# EAGLE design oresat-backplane-for-0.3 (EAGLE 7.3.0)

## Sheet 1 of 3
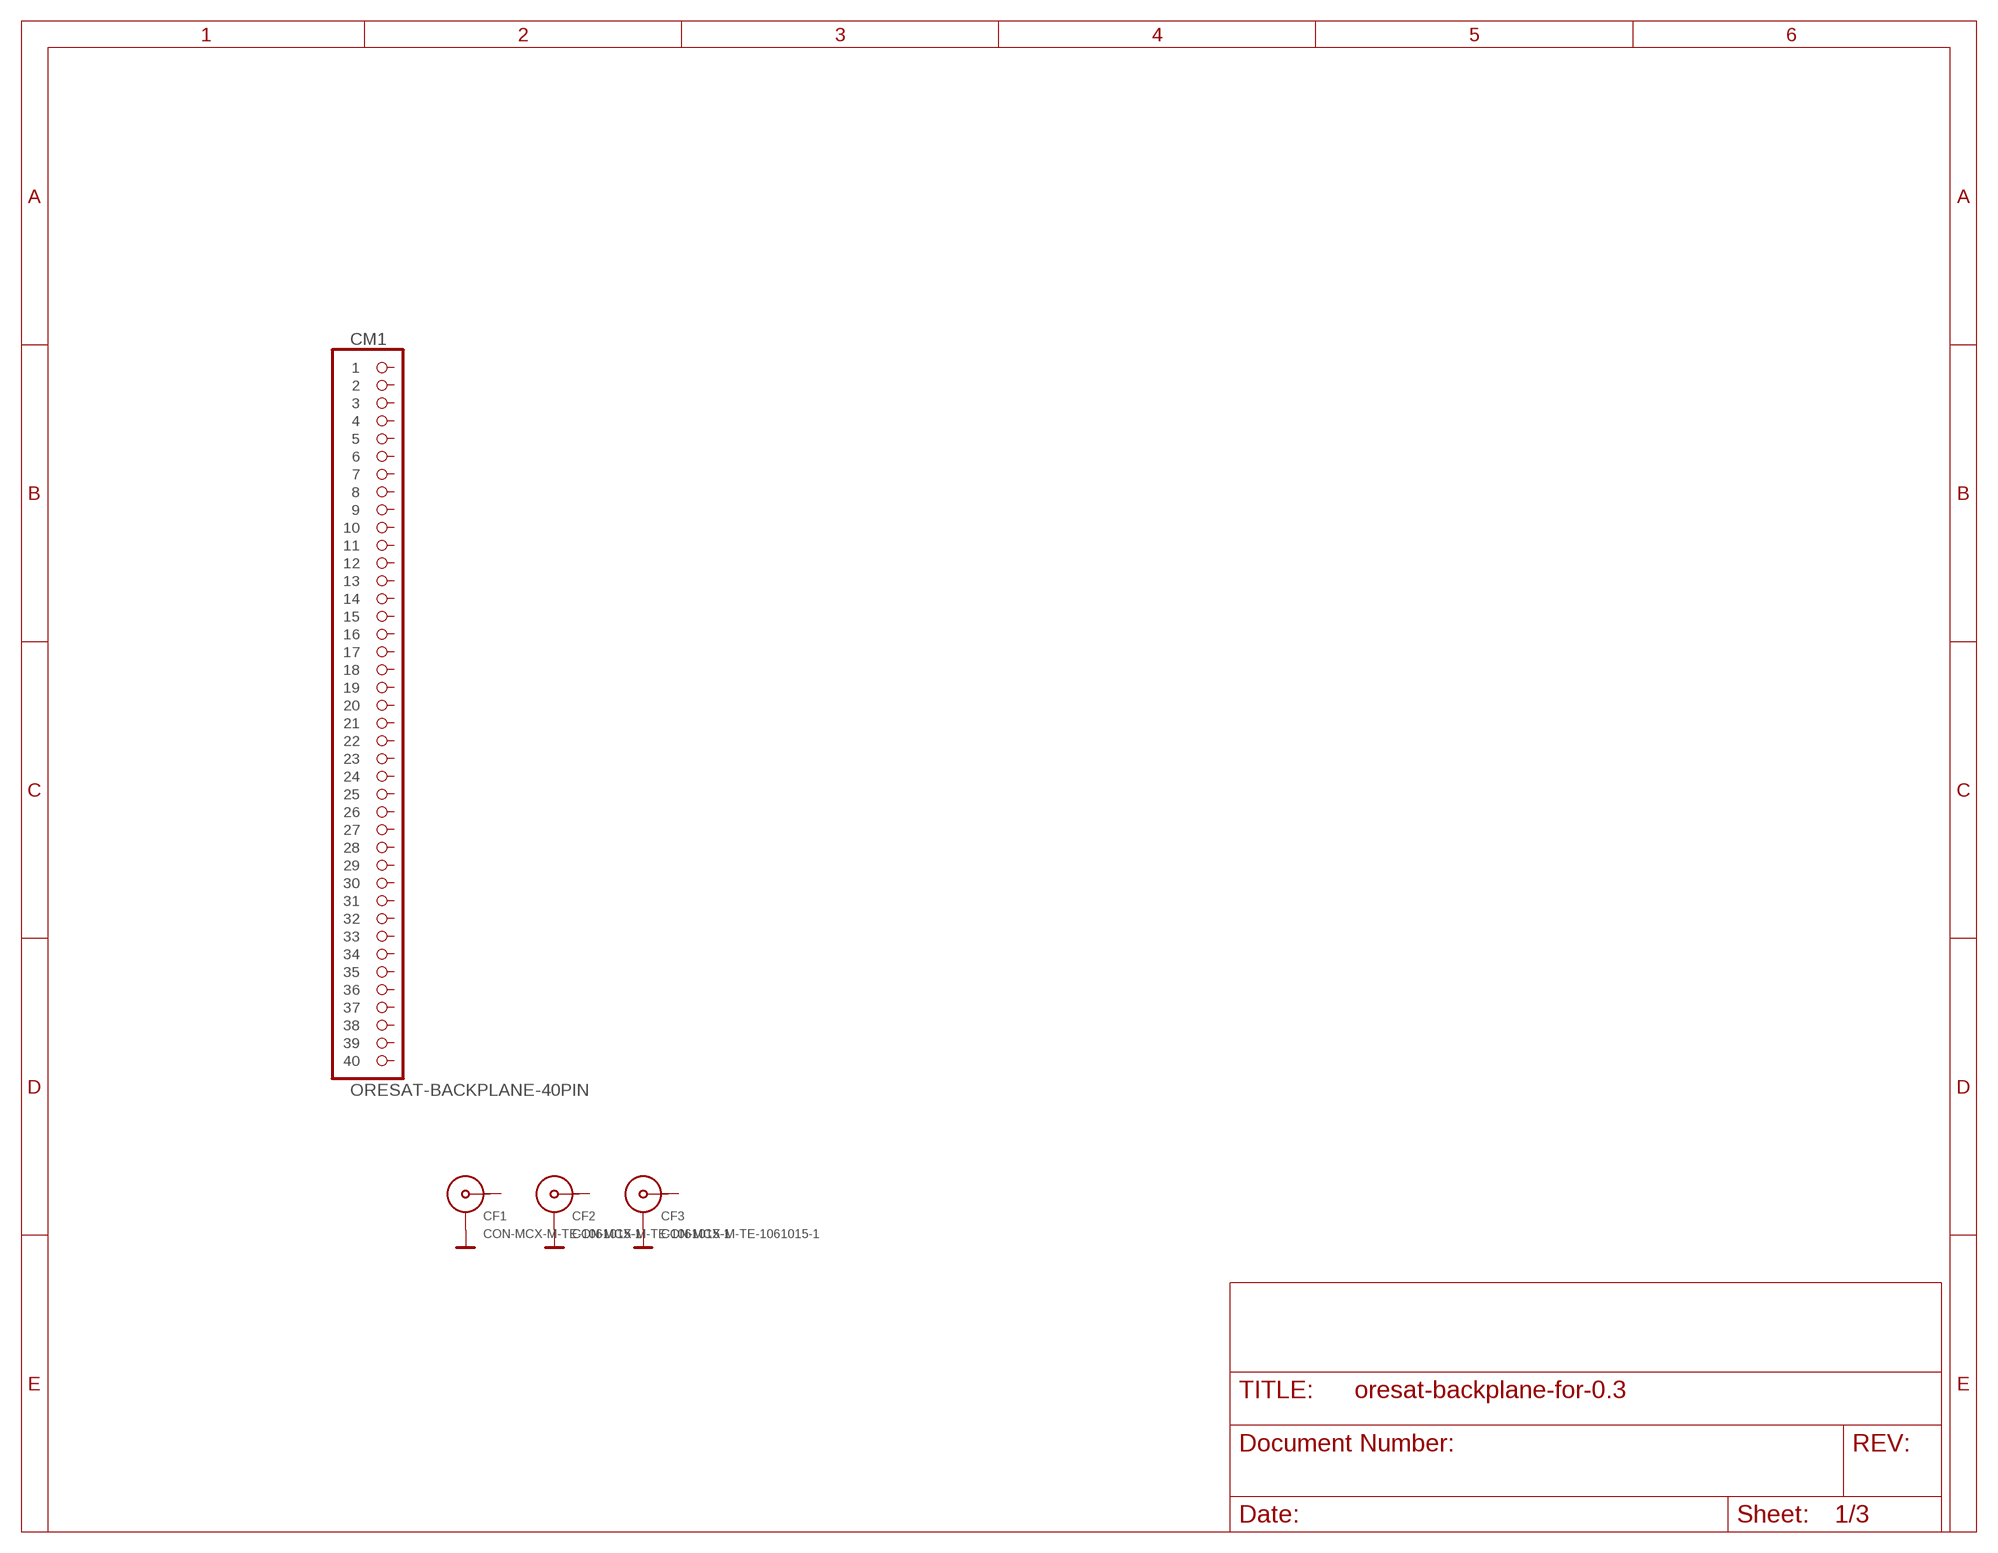
[diagram p0: schematic, sheet 1]

### Parts
CF1  CON-MCX-M-TE-1061015-1  [CONN_1061015-1_TYCO]
CF2  CON-MCX-M-TE-1061015-1  [CONN_1061015-1_TYCO]
CF3  CON-MCX-M-TE-1061015-1  [CONN_1061015-1_TYCO]
CM1  ORESAT-BACKPLANE-40PIN  [HARWIN-ARCHER-M50-3502042]

### Nets
GND: CF1.SHIELD1(SHIELD) CF1.SHIELD2(SHIELD) CF1.SHIELD3(SHIELD) CF1.SHIELD4(SHIELD) CF2.SHIELD1(SHIELD) CF2.SHIELD2(SHIELD) CF2.SHIELD3(SHIELD) CF2.SHIELD4(SHIELD) CF3.SHIELD1(SHIELD) CF3.SHIELD2(SHIELD) CF3.SHIELD3(SHIELD) CF3.SHIELD4(SHIELD) ; also sheet 2,3
Unconnected: CF1.CENTER CF2.CENTER CF3.CENTER CM1.P$1 CM1.P$2 CM1.P$3 CM1.P$4 CM1.P$5 CM1.P$6 CM1.P$7 CM1.P$8 CM1.P$9 CM1.P$10 CM1.P$11 CM1.P$12 CM1.P$13 CM1.P$14 CM1.P$15 CM1.P$16 CM1.P$17 CM1.P$18 CM1.P$19 CM1.P$20 CM1.P$21 CM1.P$22 CM1.P$23 CM1.P$24 CM1.P$25 CM1.P$26 CM1.P$27 CM1.P$28 CM1.P$29 CM1.P$30 CM1.P$31 CM1.P$32 CM1.P$33 CM1.P$34 CM1.P$35 CM1.P$36 CM1.P$37 CM1.P$38 CM1.P$39 CM1.P$40

## Sheet 2 of 3
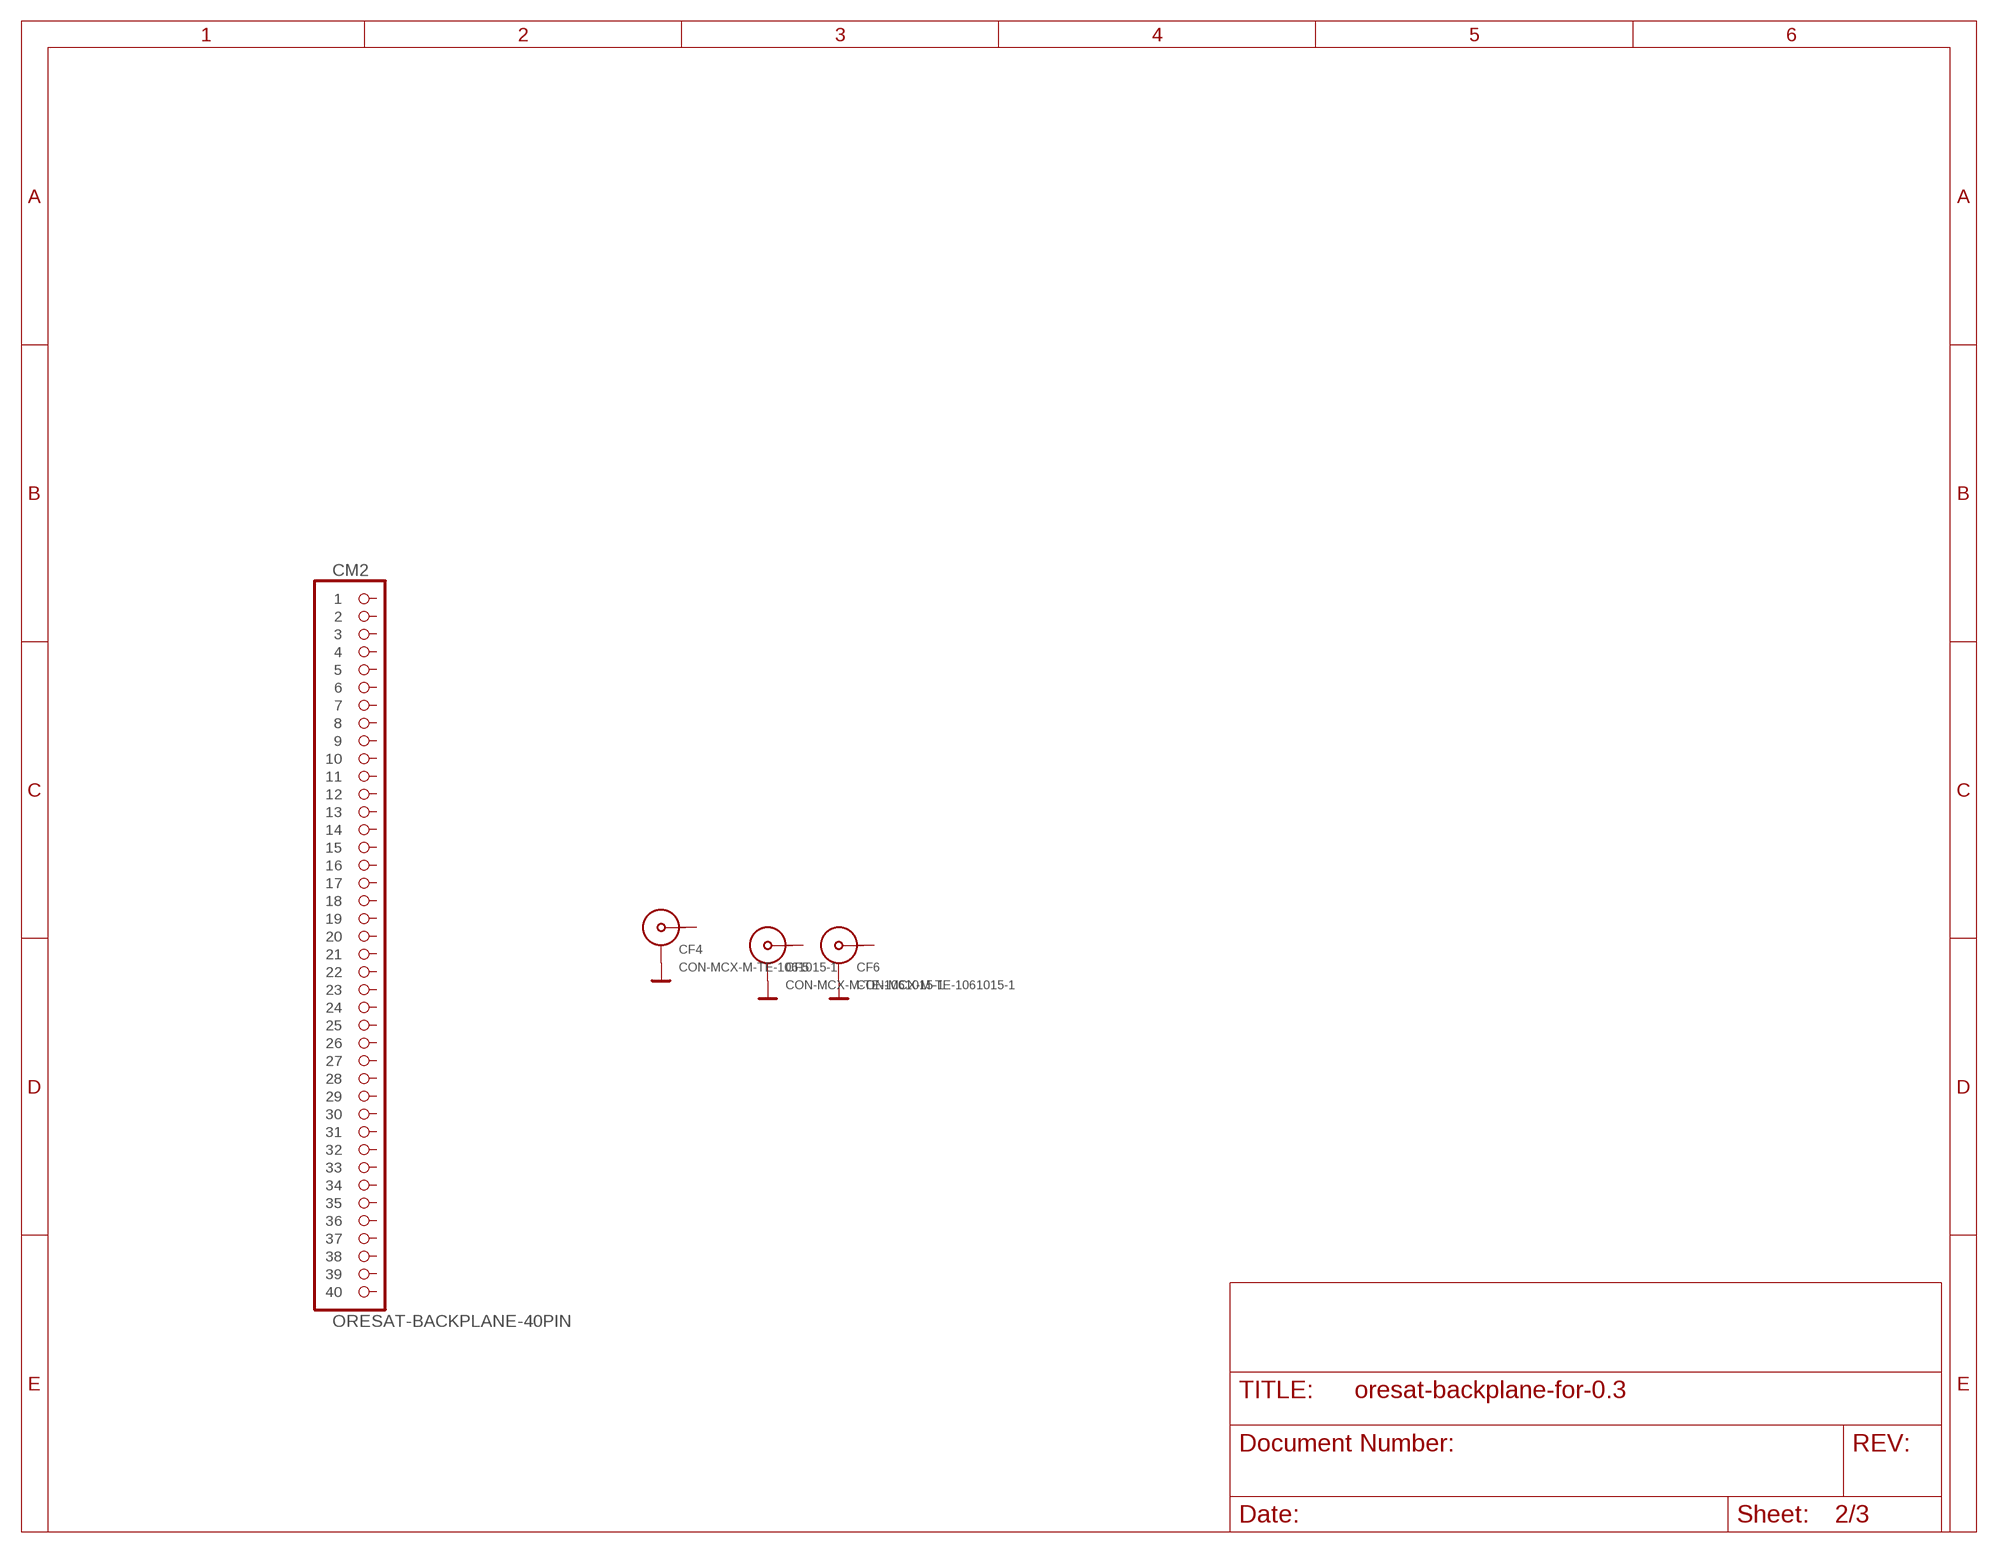
[diagram p1: schematic, sheet 2]

### Parts
CF4  CON-MCX-M-TE-1061015-1  [CONN_1061015-1_TYCO]
CF5  CON-MCX-M-TE-1061015-1  [CONN_1061015-1_TYCO]
CF6  CON-MCX-M-TE-1061015-1  [CONN_1061015-1_TYCO]
CM2  ORESAT-BACKPLANE-40PIN  [HARWIN-ARCHER-M50-3502042]

### Nets
GND: CF4.SHIELD1(SHIELD) CF4.SHIELD2(SHIELD) CF4.SHIELD3(SHIELD) CF4.SHIELD4(SHIELD) CF5.SHIELD1(SHIELD) CF5.SHIELD2(SHIELD) CF5.SHIELD3(SHIELD) CF5.SHIELD4(SHIELD) CF6.SHIELD1(SHIELD) CF6.SHIELD2(SHIELD) CF6.SHIELD3(SHIELD) CF6.SHIELD4(SHIELD) ; also sheet 1,3
Unconnected: CF4.CENTER CF5.CENTER CF6.CENTER CM2.P$1 CM2.P$2 CM2.P$3 CM2.P$4 CM2.P$5 CM2.P$6 CM2.P$7 CM2.P$8 CM2.P$9 CM2.P$10 CM2.P$11 CM2.P$12 CM2.P$13 CM2.P$14 CM2.P$15 CM2.P$16 CM2.P$17 CM2.P$18 CM2.P$19 CM2.P$20 CM2.P$21 CM2.P$22 CM2.P$23 CM2.P$24 CM2.P$25 CM2.P$26 CM2.P$27 CM2.P$28 CM2.P$29 CM2.P$30 CM2.P$31 CM2.P$32 CM2.P$33 CM2.P$34 CM2.P$35 CM2.P$36 CM2.P$37 CM2.P$38 CM2.P$39 CM2.P$40

## Sheet 3 of 3
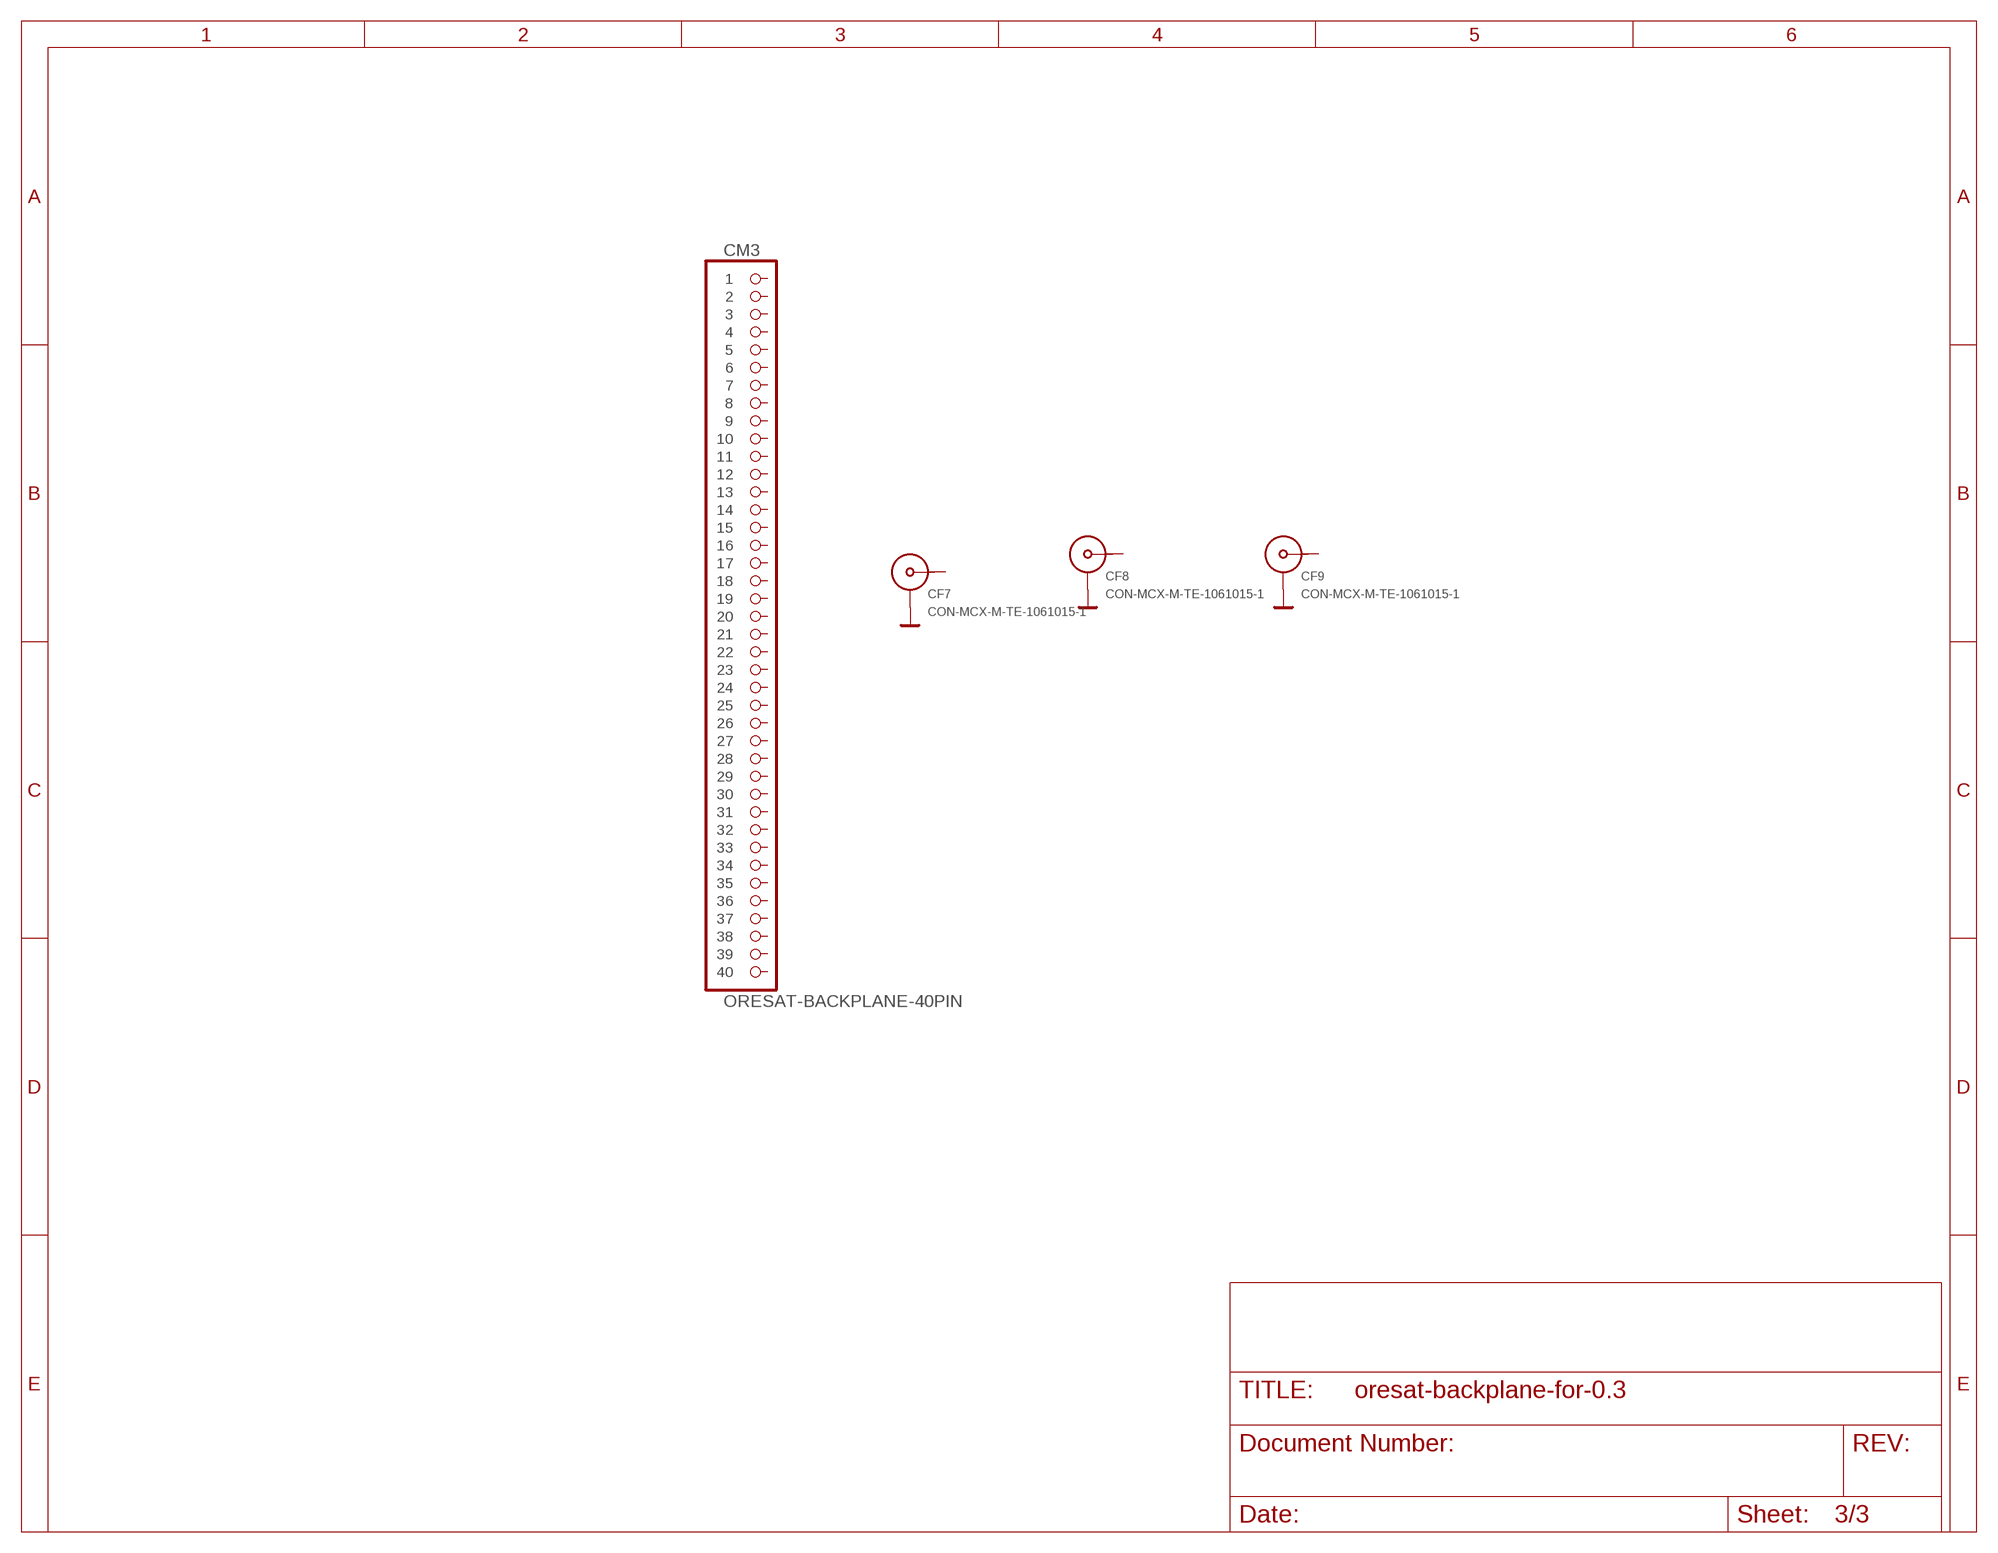
[diagram p2: schematic, sheet 3]

### Parts
CF7  CON-MCX-M-TE-1061015-1  [CONN_1061015-1_TYCO]
CF8  CON-MCX-M-TE-1061015-1  [CONN_1061015-1_TYCO]
CF9  CON-MCX-M-TE-1061015-1  [CONN_1061015-1_TYCO]
CM3  ORESAT-BACKPLANE-40PIN  [HARWIN-ARCHER-M50-3502042]

### Nets
GND: CF7.SHIELD1(SHIELD) CF7.SHIELD2(SHIELD) CF7.SHIELD3(SHIELD) CF7.SHIELD4(SHIELD) CF8.SHIELD1(SHIELD) CF8.SHIELD2(SHIELD) CF8.SHIELD3(SHIELD) CF8.SHIELD4(SHIELD) CF9.SHIELD1(SHIELD) CF9.SHIELD2(SHIELD) CF9.SHIELD3(SHIELD) CF9.SHIELD4(SHIELD) ; also sheet 1,2
Unconnected: CF7.CENTER CF8.CENTER CF9.CENTER CM3.P$1 CM3.P$2 CM3.P$3 CM3.P$4 CM3.P$5 CM3.P$6 CM3.P$7 CM3.P$8 CM3.P$9 CM3.P$10 CM3.P$11 CM3.P$12 CM3.P$13 CM3.P$14 CM3.P$15 CM3.P$16 CM3.P$17 CM3.P$18 CM3.P$19 CM3.P$20 CM3.P$21 CM3.P$22 CM3.P$23 CM3.P$24 CM3.P$25 CM3.P$26 CM3.P$27 CM3.P$28 CM3.P$29 CM3.P$30 CM3.P$31 CM3.P$32 CM3.P$33 CM3.P$34 CM3.P$35 CM3.P$36 CM3.P$37 CM3.P$38 CM3.P$39 CM3.P$40

## Library data of the parts
CF1-CF9 = oresat-eagle:CON-MCX-M-TE-1061015-1; COPYRIGHT: Copyright (C) 2015 Accelerated Designs. All rights reserved; FAMILY: Connector RF; MANUFACTURER_NAME: Tyco Electronics Amp; MANUFACTURER_PART_NUMBER: 1061015-1; RSPARTNUMBER: 7130953; SECTION: RF or Coaxial; SUPERSECTION: Connectors; VENDOR: Tyco Electronics
CM1-CM3 = oresat-eagle:ORESAT-BACKPLANE-40PIN

## Board
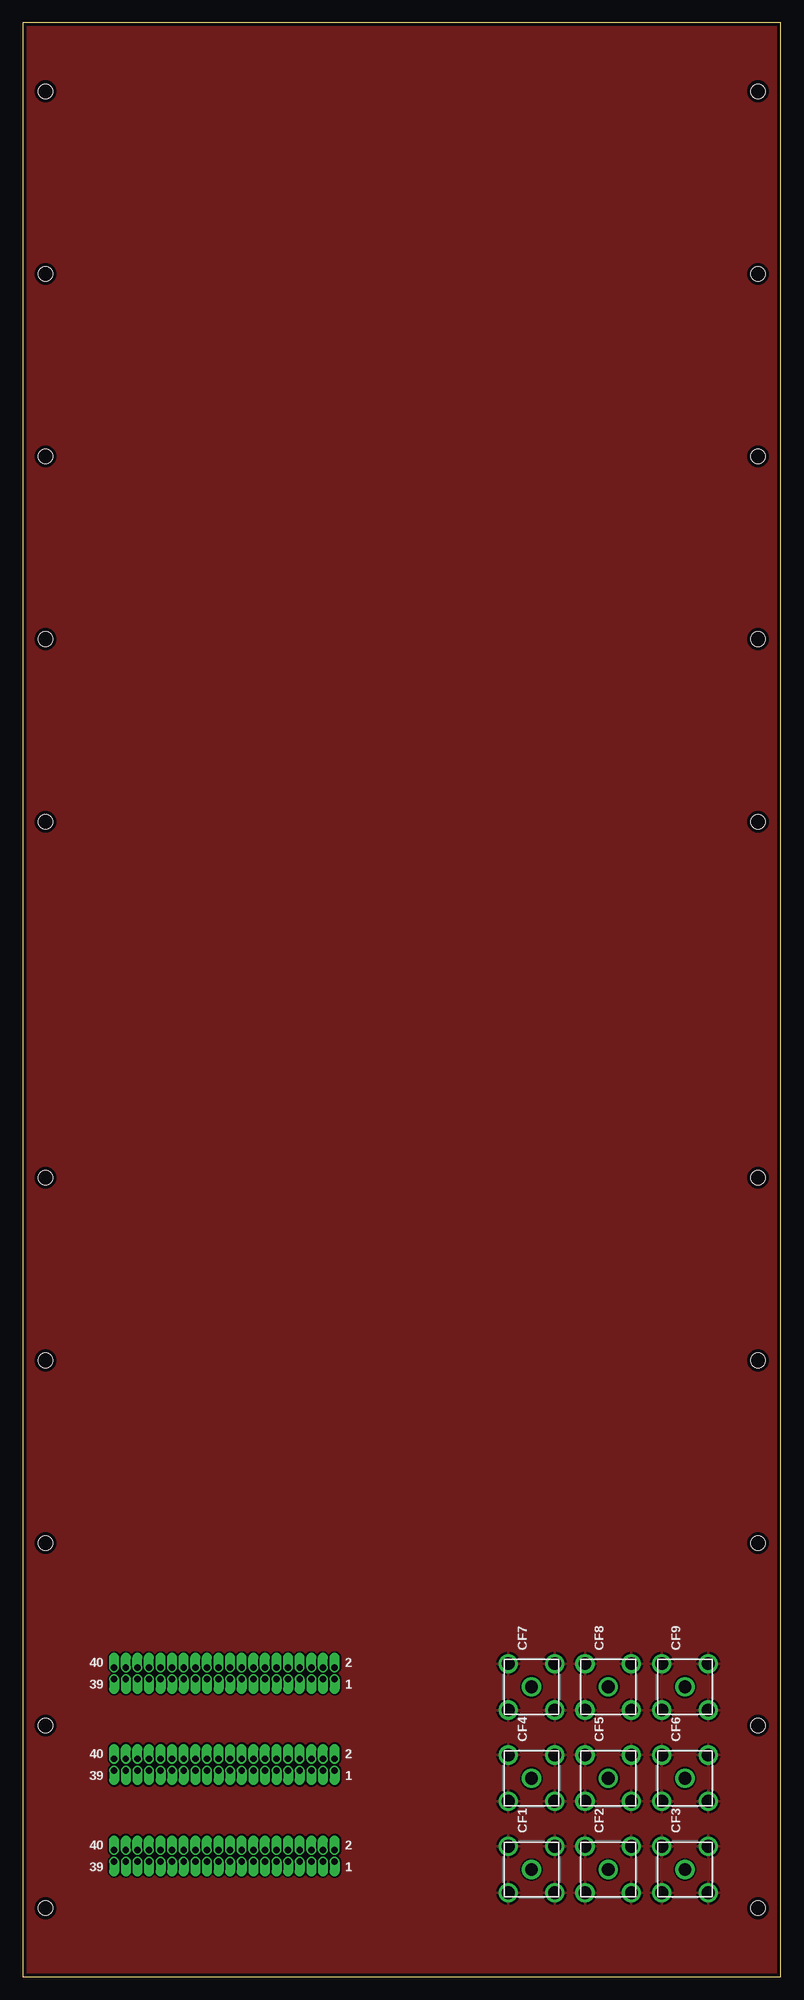
[diagram p3: board, top side]
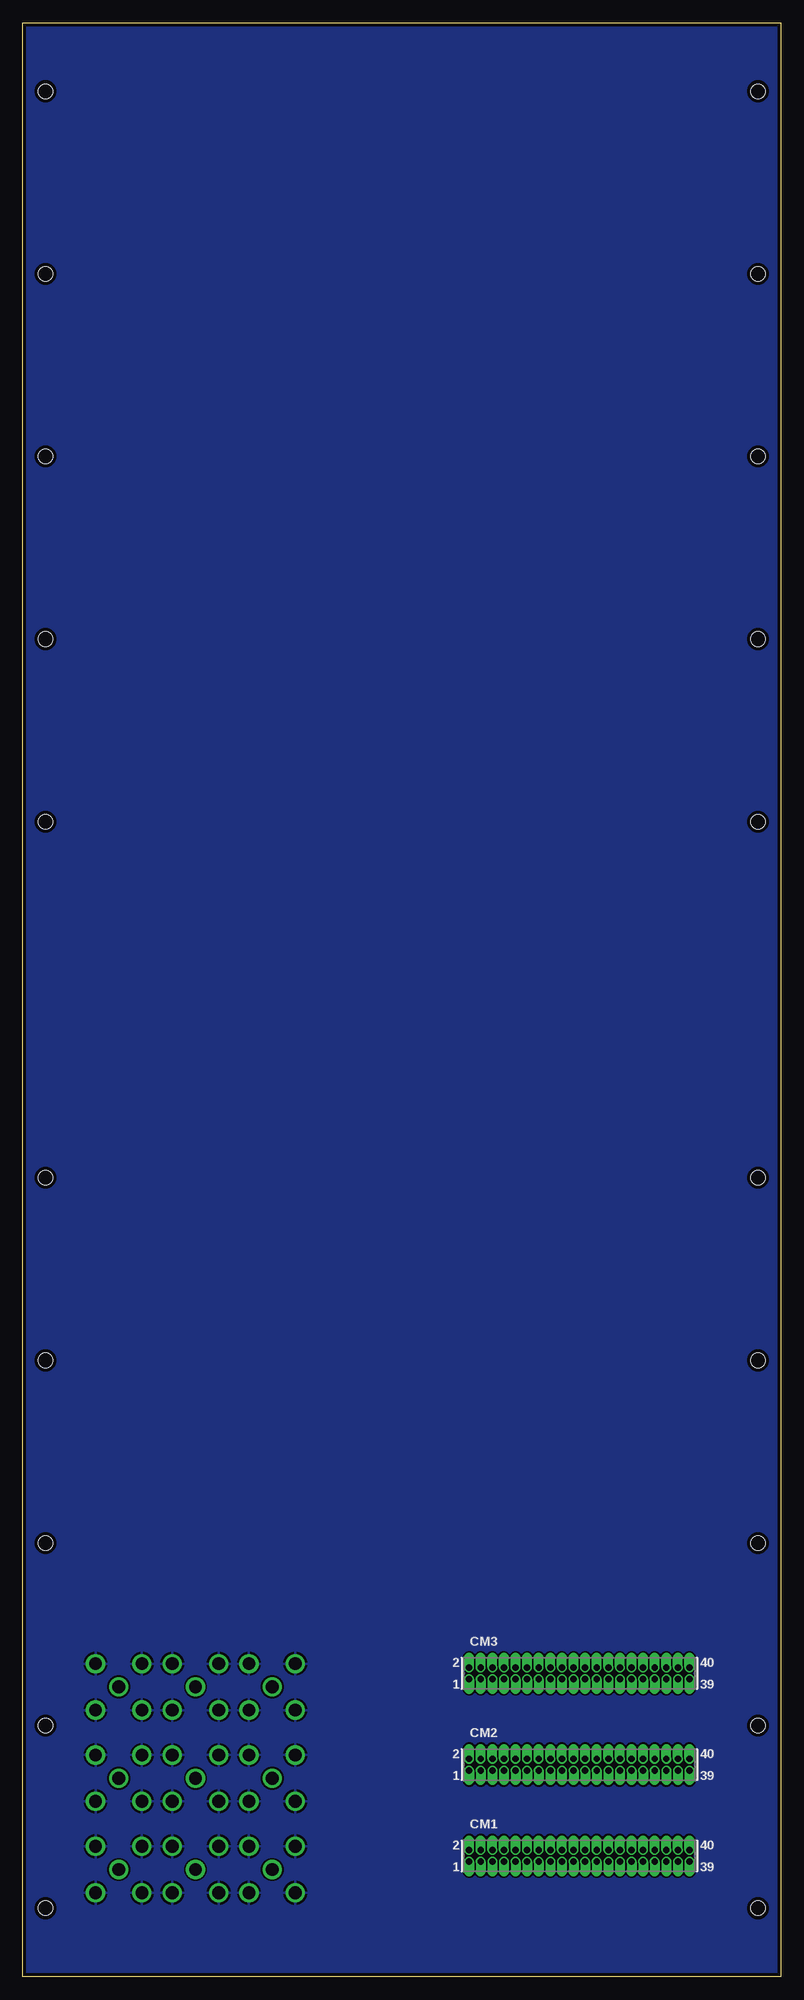
[diagram p4: board, bottom side, seen from below]

Size 83 x 214 mm. Coordinates in mm from the lower left corner, seen from the top.
Outline: 0,0 83,0 83,214 0,214 0,0
Copper layers (1*2*15*16): Top 0.035559375mm / dielectric 0.17018125mm / Route2 0.01778125mm / dielectric 47mil / Route15 0.01778125mm / dielectric 0.17018125mm / Bottom 0.035559375mm
Design rules "oshpark_4lyr": minimum track width 5mil, minimum drill 10mil, track to track 5mil, track to pad 5mil, pad to pad 5mil, via to via 5mil, smd to smd 5mil, copper to edge 15mil, drill to drill 6mil, minimum pad ring 4mil, minimum via ring 4mil, stop-mask expansion 4mil, vias tented up to drill 0mil, thermal gap 10mil
Holes 1.61 mm at 2.5,7.5 2.5,27.5 2.5,47.5 2.5,67.5 2.5,87.5 2.5,126.5 2.5,146.5 2.5,166.5 2.5,186.5 2.5,206.5 80.5,7.5 80.5,27.5 80.5,47.5 80.5,67.5 80.5,87.5 80.5,126.5 80.5,146.5 80.5,166.5 80.5,186.5 80.5,206.5
tKeepout: area 0,5 to 5,10; area 78,5 to 83,10; area 0,25 to 5,30; area 78,25 to 83,30; area 0,45 to 5,50; area 78,45 to 83,50; area 0,65 to 5,70; area 78,65 to 83,70; area 0,85 to 5,90; area 78,85 to 83,90; area 0,124 to 5,129; area 78,124 to 83,129; 10 more areas

### Footprints (pad centres in the part's own frame; a part is rotated, then mirrored left to right if it is on the bottom)
CONN_1061015-1_TYCO = drill 1.397: CENTER 0,0; SHIELD1 -2.54,-2.54; SHIELD2 2.54,-2.54; SHIELD3 2.54,2.54; SHIELD4 -2.54,2.54
HARWIN-ARCHER-M50-3502042 = drill 0.7 pad 1.07 offset: P$1 -12.065,-0.635; P$2 -12.065,0.635; P$3 -10.795,-0.635; P$4 -10.795,0.635; P$5 -9.525,-0.635; P$6 -9.525,0.635; P$7 -8.255,-0.635; P$8 -8.255,0.635; P$9 -6.985,-0.635; P$10 -6.985,0.635; P$11 -5.715,-0.635; P$12 -5.715,0.635; P$13 -4.445,-0.635; P$14 -4.445,0.635; P$15 -3.175,-0.635; P$16 -3.175,0.635; P$17 -1.905,-0.635; P$18 -1.905,0.635; P$19 -0.635,-0.635; P$20 -0.635,0.635; P$21 0.635,-0.635; P$22 0.635,0.635; P$23 1.905,-0.635; P$24 1.905,0.635; P$25 3.175,-0.635; P$26 3.175,0.635; P$27 4.445,-0.635; P$28 4.445,0.635; P$29 5.715,-0.635; P$30 5.715,0.635; P$31 6.985,-0.635; P$32 6.985,0.635; P$33 8.255,-0.635; P$34 8.255,0.635; P$35 9.525,-0.635; P$36 9.525,0.635; P$37 10.795,-0.635; P$38 10.795,0.635; P$39 12.065,-0.635; P$40 12.065,0.635

### Placement (x,y rotation side)
CF1  55.7,11.74 90 top
CF2  64.1,11.74 90 top
CF3  72.5,11.74 90 top
CF4  55.7,21.74 90 top
CF5  64.1,21.74 90 top
CF6  72.5,21.74 90 top
CF7  55.7,31.74 90 top
CF8  64.1,31.74 90 top
CF9  72.5,31.74 90 top
CM1  22.07,13.22 0 bottom
CM2  22.07,23.23 0 bottom
CM3  22.07,33.23 0 bottom

### Tracks (layer width: path | path; a pad name or v marks a point on that pad's centre or on a via)
GND
  pour Top (isolate 0.2, rank 6): 0,0 0,214 83,214 83,0
  pour Bottom (isolate 0.2, rank 6): 0,0 0,214 83,214 83,0